# Altium schematic sheet 2-MCU.SchDoc
size A4
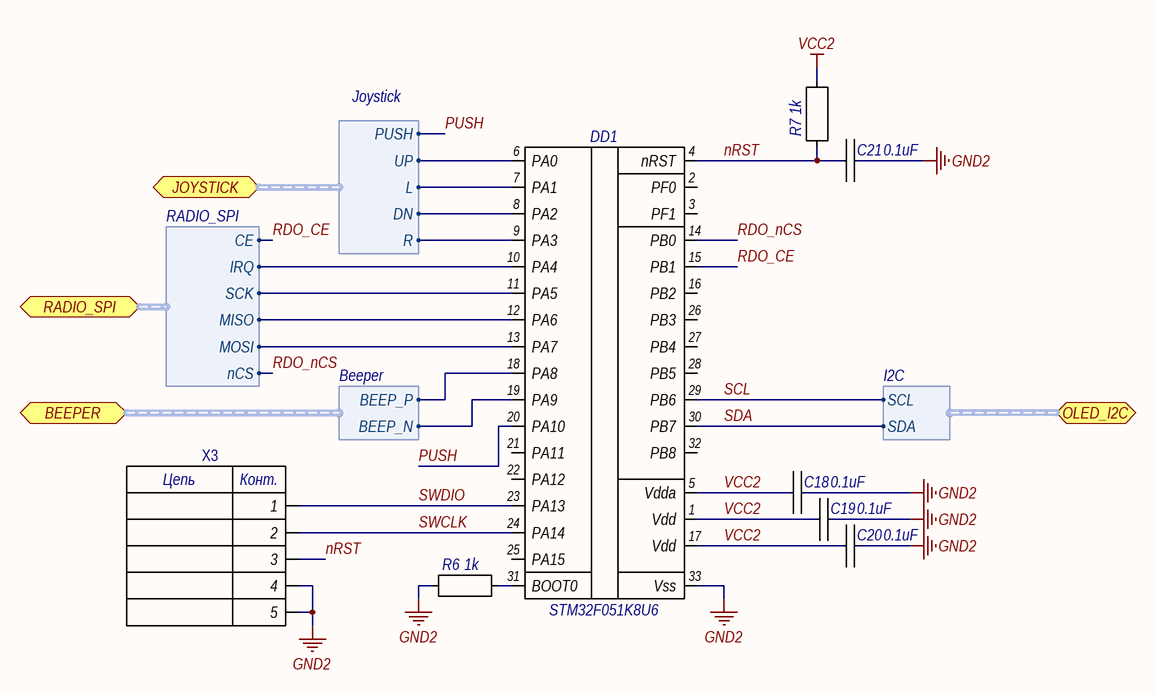
[diagram p0: 2-MCU.SchDoc]

## Parts
C18  value 0.1uF  [CHIP_0402_C]  (hidden comment: Конденсатор)
C19  value 0.1uF  [CHIP_0402_C]  (hidden comment: Конденсатор)
C20  value 0.1uF  [CHIP_0402_C]  (hidden comment: Конденсатор)
C21  value 0.1uF  [CHIP_0402_C]  (hidden comment: Конденсатор)
DD1  PartNumber: STM32F051K8U6  [UFQFPN32]  (hidden comment: STM32F0xx_32)
R6  value 1k  [CHIP_0402_R]  (hidden comment: Резистор)
R7  value 1k  [CHIP_0402_R]  (hidden comment: Резистор)
X3  SWD for STM32  [STM32 SWD-4]  (value not drawn)  (no BOM)

## Ports
BEEPER (harness Beeper), JOYSTICK (harness Joystick), OLED_I2C (harness I2C), RADIO_SPI (harness RADIO_SPI)

## Harnesses
Joystick: UP, DN, L, R, PUSH
Beeper: BEEP_P, BEEP_N
I2C: SCL, SDA
RADIO_SPI: CE, nCS, SCK, MOSI, MISO, IRQ

## Nets
GND2: C18.1 C19.1 C20.1 C21.1 DD1.33(Vss) R6.1 X3.4 X3.5
VCC2: C18.2 C19.2 C20.2 DD1.1(Vdd) DD1.5(Vdda) DD1.17(Vdd) R7.2
nRST: C21.2 DD1.4(nRST) R7.1 X3.3
PUSH: DD1.20(PA10) ; port JOYSTICK.PUSH
RDO_CE: DD1.15(PB1) ; port RADIO_SPI.CE
RDO_nCS: DD1.14(PB0) ; port RADIO_SPI.nCS
SCL: DD1.29(PB6) ; port OLED_I2C.SCL
SDA: DD1.30(PB7) ; port OLED_I2C.SDA
SWCLK: DD1.24(PA14) X3.2
SWDIO: DD1.23(PA13) X3.1
NetDD1_6: DD1.6(PA0) ; port JOYSTICK.UP
NetDD1_7: DD1.7(PA1) ; port JOYSTICK.L
NetDD1_8: DD1.8(PA2) ; port JOYSTICK.DN
NetDD1_9: DD1.9(PA3) ; port JOYSTICK.R
NetDD1_10: DD1.10(PA4) ; port RADIO_SPI.IRQ
NetDD1_11: DD1.11(PA5) ; port RADIO_SPI.SCK
NetDD1_12: DD1.12(PA6) ; port RADIO_SPI.MISO
NetDD1_13: DD1.13(PA7) ; port RADIO_SPI.MOSI
NetDD1_18: DD1.18(PA8) ; port BEEPER.BEEP_P
NetDD1_19: DD1.19(PA9) ; port BEEPER.BEEP_N
NetDD1_31: DD1.31(BOOT0) R6.2

Not connected (* = marked no-connect by the designer): DD1 2(PF0) 3(PF1) 16(PB2) 21(PA11) 22(PA12) 25(PA15) 26(PB3) 27(PB4) 28(PB5) 32(PB8)

## Notes on the sheet
- (in symbol SWD_STM32) Цепь; Конт.

## Library data of the parts
C18-C21 = Конденсатор: PartNumber: CC0402KRX7R7BB104; Mfg: YAGEO
DD1 = STM32F0xx_32: MCU, 32-leaded; Mfg: ST
R6 R7 = Резистор: PartNumber: RC0402FR-071KL; Mfg: YAGEO
X3 = SWD_STM32: Конт. площадки для подключения SWD; pin to pad: 5>4